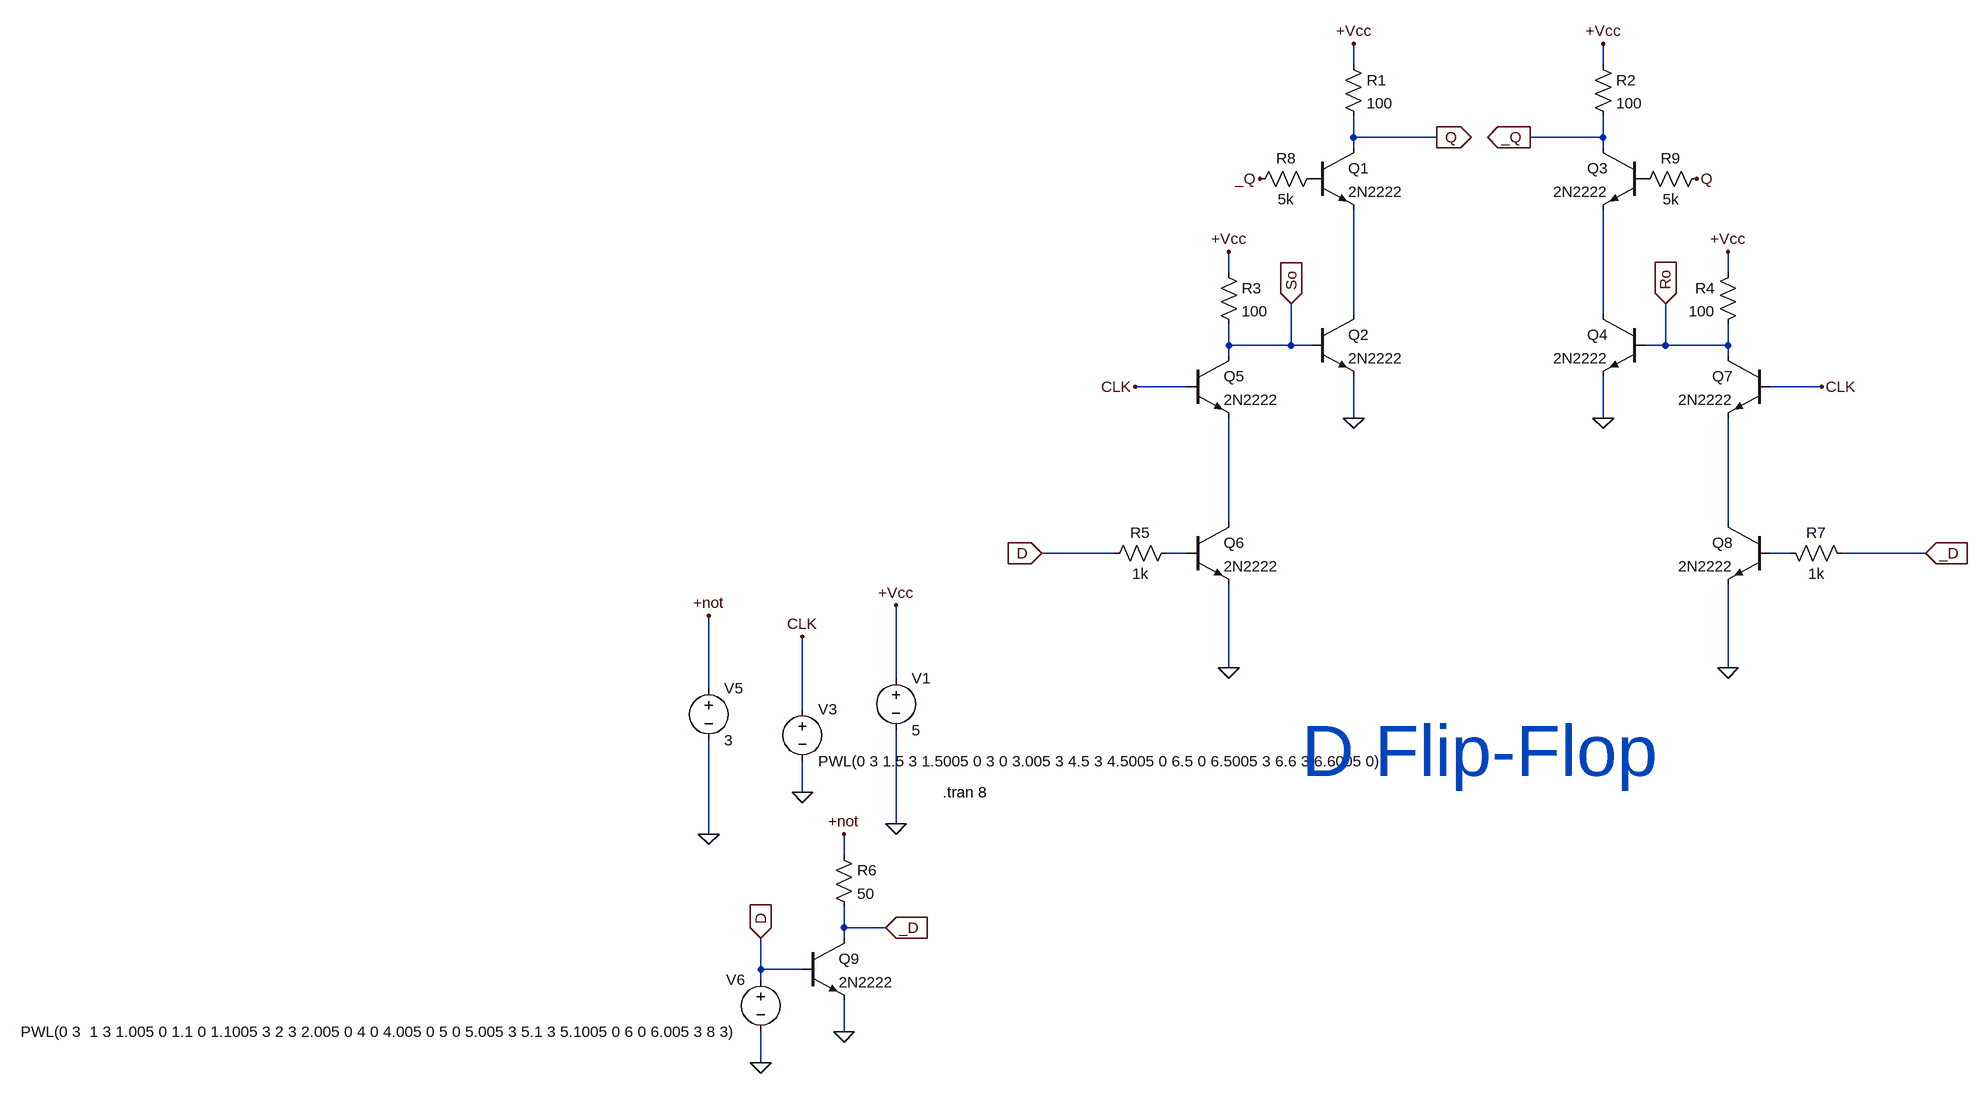
[diagram p0: schematic D-FlipFlop.asc]
D-FlipFlop.asc, the LTspice schematic file:
Version 4
SHEET 1 2620 1520
WIRE 368 -32 368 -64
WIRE 752 -32 752 -64
WIRE 368 80 368 48
WIRE 496 80 368 80
WIRE 752 80 752 48
WIRE 752 80 640 80
WIRE 368 96 368 80
WIRE 752 96 752 80
WIRE 176 288 176 256
WIRE 944 288 944 256
WIRE 368 352 368 192
WIRE 752 352 752 192
WIRE 176 400 176 368
WIRE 272 400 272 336
WIRE 272 400 176 400
WIRE 304 400 272 400
WIRE 848 400 848 336
WIRE 848 400 816 400
WIRE 944 400 944 368
WIRE 944 400 848 400
WIRE 176 416 176 400
WIRE 944 416 944 400
WIRE 112 464 32 464
WIRE 1088 464 1008 464
WIRE 368 512 368 448
WIRE 752 512 752 448
WIRE 176 672 176 512
WIRE 944 672 944 512
WIRE 0 720 -112 720
WIRE 112 720 80 720
WIRE 1040 720 1008 720
WIRE 1248 720 1120 720
WIRE 176 896 176 768
WIRE 944 896 944 768
WIRE -336 912 -336 800
WIRE -624 928 -624 816
WIRE -480 960 -480 848
WIRE -480 1088 -480 1040
WIRE -336 1136 -336 992
WIRE -624 1152 -624 1008
WIRE -416 1184 -416 1152
WIRE -416 1296 -416 1264
WIRE -352 1296 -416 1296
WIRE -416 1312 -416 1296
WIRE -544 1360 -544 1312
WIRE -480 1360 -544 1360
WIRE -544 1376 -544 1360
WIRE -416 1456 -416 1408
WIRE -544 1504 -544 1456
FLAG -336 800 +Vcc
FLAG -336 1136 0
FLAG -480 1088 0
FLAG -416 1152 +not
FLAG -416 1456 0
FLAG -352 1296 _D
IOPIN -352 1296 In
FLAG -544 1504 0
FLAG -544 1312 D
IOPIN -544 1312 In
FLAG -480 848 CLK
FLAG 368 -64 +Vcc
FLAG 752 -64 +Vcc
FLAG 176 256 +Vcc
FLAG 176 896 0
FLAG 944 256 +Vcc
FLAG 944 896 0
FLAG 496 80 Q
IOPIN 496 80 Out
FLAG 640 80 _Q
IOPIN 640 80 Out
FLAG 752 512 0
FLAG 368 512 0
FLAG 848 336 Ro
IOPIN 848 336 In
FLAG 272 336 So
IOPIN 272 336 In
FLAG -112 720 D
IOPIN -112 720 In
FLAG 1248 720 _D
IOPIN 1248 720 In
FLAG 32 464 CLK
FLAG 1088 464 CLK
FLAG 896 144 Q
FLAG 224 144 _Q
FLAG -624 816 +not
FLAG -624 1152 0
SYMBOL voltage -336 896 R0
SYMATTR InstName V1
SYMATTR Value 5
SYMBOL voltage -480 944 R0
SYMATTR InstName V3
SYMATTR Value PWL(0 3 1.5 3 1.5005 0 3 0 3.005 3 4.5 3 4.5005 0 6.5 0 6.5005 3 6.6 3 6.6005 0)
SYMBOL npn -480 1312 R0
SYMATTR InstName Q9
SYMATTR Value 2N2222
SYMBOL Res -432 1168 R0
SYMATTR InstName R6
SYMATTR Value 50
SYMBOL voltage -544 1360 M0
SYMATTR InstName V6
SYMATTR Value PWL(0 3  1 3 1.005 0 1.1 0 1.1005 3 2 3 2.005 0 4 0 4.005 0 5 0 5.005 3 5.1 3 5.1005 0 6 0 6.005 3 8 3)
SYMBOL npn 304 96 R0
SYMATTR InstName Q1
SYMATTR Value 2N2222
SYMBOL npn 304 352 R0
SYMATTR InstName Q2
SYMATTR Value 2N2222
SYMBOL npn 816 96 M0
SYMATTR InstName Q3
SYMATTR Value 2N2222
SYMBOL npn 816 352 M0
SYMATTR InstName Q4
SYMATTR Value 2N2222
SYMBOL Res 352 -48 R0
SYMATTR InstName R1
SYMATTR Value 100
SYMBOL Res 736 -48 R0
SYMATTR InstName R2
SYMATTR Value 100
SYMBOL npn 112 416 R0
SYMATTR InstName Q5
SYMATTR Value 2N2222
SYMBOL npn 112 672 R0
SYMATTR InstName Q6
SYMATTR Value 2N2222
SYMBOL Res 160 272 R0
SYMATTR InstName R3
SYMATTR Value 100
SYMBOL npn 1008 416 M0
SYMATTR InstName Q7
SYMATTR Value 2N2222
SYMBOL npn 1008 672 M0
SYMATTR InstName Q8
SYMATTR Value 2N2222
SYMBOL Res 960 272 M0
SYMATTR InstName R4
SYMATTR Value 100
SYMBOL Res 96 704 R90
WINDOW 0 0 56 VBottom 2
WINDOW 3 32 56 VTop 2
SYMATTR InstName R5
SYMATTR Value 1k
SYMBOL Res 1136 736 M270
WINDOW 0 32 56 VTop 2
WINDOW 3 0 56 VBottom 2
SYMATTR InstName R7
SYMATTR Value 1k
SYMBOL Res 320 128 R90
WINDOW 0 0 56 VBottom 2
WINDOW 3 32 56 VTop 2
SYMATTR InstName R8
SYMATTR Value 5k
SYMBOL Res 912 128 R90
WINDOW 0 0 56 VBottom 2
WINDOW 3 32 56 VTop 2
SYMATTR InstName R9
SYMATTR Value 5k
SYMBOL voltage -624 912 R0
SYMATTR InstName V5
SYMATTR Value 3
TEXT -264 1088 Left 2 !.tran 8
TEXT 288 1024 Left 7 ;D Flip-Flop

The netlist it stands for:
* D-FlipFlop.asc
V1 +Vcc 0 5
V3 CLK 0 PWL(0 3 1.5 3 1.5005 0 3 0 3.005 3 4.5 3 4.5005 0 6.5 0 6.5005 3 6.6 3 6.6005 0)
Q9 _D D 0 0 2N2222
R6 +not _D 50
V6 D 0 PWL(0 3  1 3 1.005 0 1.1 0 1.1005 3 2 3 2.005 0 4 0 4.005 0 5 0 5.005 3 5.1 3 5.1005 0 6 0 6.005 3 8 3)
Q1 Q P001 N001 0 2N2222
Q2 N001 So 0 0 2N2222
Q3 _Q P002 N002 0 2N2222
Q4 N002 Ro 0 0 2N2222
R1 +Vcc Q 100
R2 +Vcc _Q 100
Q5 So CLK N003 0 2N2222
Q6 N003 N005 0 0 2N2222
R3 +Vcc So 100
Q7 Ro CLK N004 0 2N2222
Q8 N004 N006 0 0 2N2222
R4 +Vcc Ro 100
R5 N005 D 1k
R7 _D N006 1k
R8 P001 _Q 5k
R9 Q P002 5k
V5 +not 0 3
.model NPN NPN
.model PNP PNP
.lib standard.bjt
.tran 8
* D Flip-Flop
.backanno
.end